# Altium schematic sheet bme_radar.SchDoc
size A4; SheetNumber: 1; SheetTotal: 1
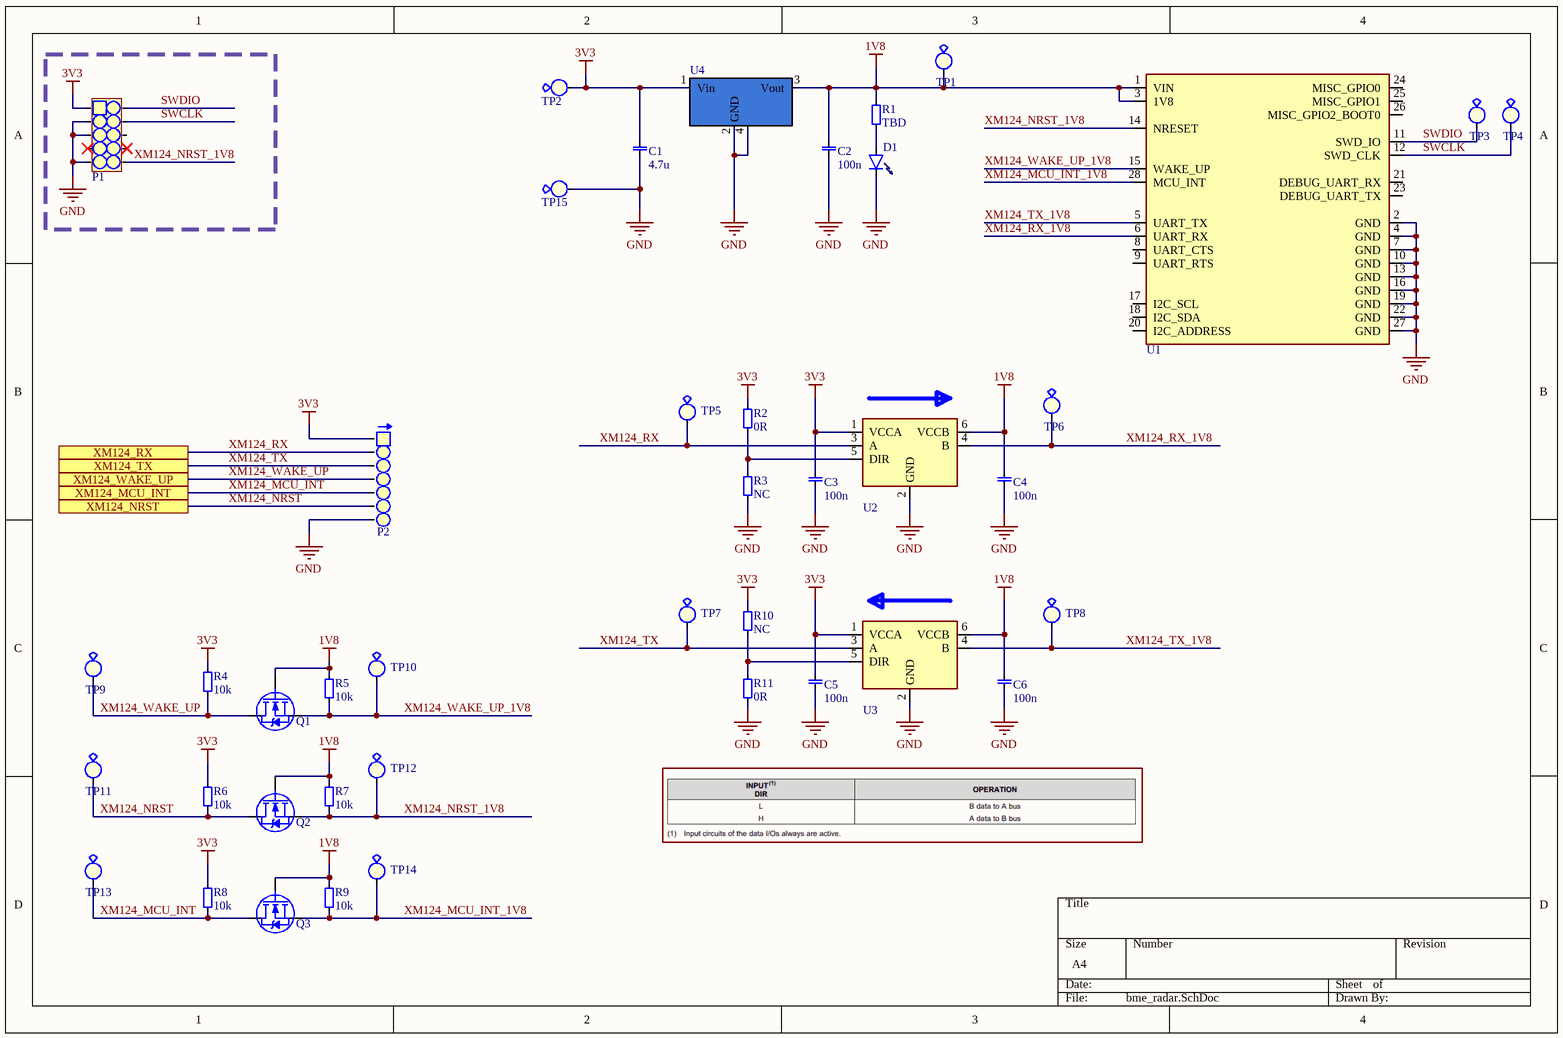
[diagram p0: bme_radar.SchDoc]

## Parts
C1  value 4.7u  [0805, cap]  (hidden comment: 0805, capacitor)
C2  value 100n  [0805, cap]  (hidden comment: 0805, capacitor)
C3  value 100n  [0402 CAP]  (hidden comment: 0603, capacitor)
C4  value 100n  [0402 CAP]  (hidden comment: 0603, capacitor)
C5  value 100n  [0402 CAP]  (hidden comment: 0603, capacitor)
C6  value 100n  [0402 CAP]  (hidden comment: 0603, capacitor)
D1  0603, LED  [0603 LED]  (value not drawn)
P1  ARM 10 pin SWD  [FTSH-105-01-L-DV-K even odd]  (value not drawn)
P2  1x7 Pin Header R/A  [1x7_HEADER_R/A]  (value not drawn)
Q1  BSS138  [SOT323]  (value not drawn)
Q2  BSS138  [SOT323]  (value not drawn)
Q3  BSS138  [SOT323]  (value not drawn)
R1  value TBD  [0603]  (hidden comment: 0603, resistor)
R2  value 0R  [0402 res]  (hidden comment: 0603, resistor)
R3  value NC  [0402 res]  (hidden comment: 0603, resistor)
R4  value 10k  [0603]  (hidden comment: 0603, resistor)
R5  value 10k  [0603]  (hidden comment: 0603, resistor)
R6  value 10k  [0603]  (hidden comment: 0603, resistor)
R7  value 10k  [0603]  (hidden comment: 0603, resistor)
R8  value 10k  [0603]  (hidden comment: 0603, resistor)
R9  value 10k  [0603]  (hidden comment: 0603, resistor)
R10  value NC  [0402 res]  (hidden comment: 0603, resistor)
R11  value 0R  [0402 res]  (hidden comment: 0603, resistor)
TP1  Test Point  [TESTPOINT_SMD]  (value not drawn)
TP2  Test Point  [TESTPOINT_SMD]  (value not drawn)
TP3  Test Point  [TESTPOINT_SMD]  (value not drawn)
TP4  Test Point  [TESTPOINT_SMD]  (value not drawn)
TP5  Test Point  [TESTPOINT_SMD]  (value not drawn)
TP6  Test Point  [TESTPOINT_SMD]  (value not drawn)
TP7  Test Point  [TESTPOINT_SMD]  (value not drawn)
TP8  Test Point  [TESTPOINT_SMD]  (value not drawn)
TP9  Test Point  [TESTPOINT_SMD]  (value not drawn)
TP10  Test Point  [TESTPOINT_SMD]  (value not drawn)
TP11  Test Point  [TESTPOINT_SMD]  (value not drawn)
TP12  Test Point  [TESTPOINT_SMD]  (value not drawn)
TP13  Test Point  [TESTPOINT_SMD]  (value not drawn)
TP14  Test Point  [TESTPOINT_SMD]  (value not drawn)
TP15  Test Point  [TESTPOINT_SMD]  (value not drawn)
U1  XM124  [XM124]  (value not drawn)
U2  SN74AXC1T45-Q1  [SOT65P210X110-6N]  (value not drawn)
U3  SN74AXC1T45-Q1  [SOT65P210X110-6N]  (value not drawn)
U4  3.3V Reg  [SOT223]  (value not drawn)

## Ports
XM124_MCU_INT, XM124_NRST, XM124_RX, XM124_TX, XM124_WAKE_UP

## Nets
1V8: C2.1 C4.1 C6.1 Q1.1(G) Q2.1(G) Q3.1(G) R1.1 R5.1 R7.1 R9.1 TP1.0 U1.1(VIN) U1.3(1V8) U2.6(VCCB) U3.6(VCCB) U4.3(Vout)
3V3: C1.1 C3.1 C5.1 P1.1 P2.1 R2.0 R4.1 R6.1 R8.1 R10.0 TP2.0 U2.1(VCCA) U3.1(VCCA) U4.1(Vin)
GND: C1.0 C2.0 C3.0 C4.0 C5.0 C6.0 D1.0(Cathode) P1.3 P1.5 P1.9 P2.7 R3.1 R11.1 TP15.0 U1.2(GND) U1.4(GND) U1.7(GND) U1.10(GND) U1.13(GND) U1.16(GND) U1.19(GND) U1.22(GND) U1.27(GND) U2.2(GND) U3.2(GND) U4.2(GND) U4.4
SWCLK: P1.4 TP4.0 U1.12(SWD_CLK)
SWDIO: P1.2 TP3.0 U1.11(SWD_IO)
XM124_MCU_INT: P2.5 Q3.2(D) R8.0 TP13.0 ; port XM124_MCU_INT
XM124_MCU_INT_1V8: Q3.3(S) R9.0 TP14.0 U1.28(MCU_INT)
XM124_NRST: P2.6 Q2.2(D) R6.0 TP11.0 ; port XM124_NRST
XM124_NRST_1V8: P1.10 Q2.3(S) R7.0 TP12.0 U1.14(NRESET)
XM124_RX: P2.2 TP5.0 U2.3(A) ; port XM124_RX
XM124_RX_1V8: TP6.0 U1.6(UART_RX) U2.4(B)
XM124_TX: P2.3 TP7.0 U3.3(A) ; port XM124_TX
XM124_TX_1V8: TP8.0 U1.5(UART_TX) U3.4(B)
XM124_WAKE_UP: P2.4 Q1.2(D) R4.0 TP9.0 ; port XM124_WAKE_UP
XM124_WAKE_UP_1V8: Q1.3(S) R5.0 TP10.0 U1.15(WAKE_UP)
NetD1_1: D1.1 R1.0
NetR2_1: R2.1 R3.0 U2.5(DIR)
NetR10_1: R10.1 R11.0 U3.5(DIR)

Not connected (* = marked no-connect by the designer): P1 6 7* 8*; U1 8(UART_CTS) 9(UART_RTS) 17(I2C_SCL) 18(I2C_SDA) 20(I2C_ADDRESS) 21(DEBUG_UART_RX) 23(DEBUG_UART_TX) 24(MISC_GPIO0) 25(MISC_GPIO1) 26(MISC_GPIO2_BOOT0)

## Library data of the parts
C1 = 0805, capacitor: Manufacturer Part No: CL21A475KAQNNNE
C2 = 0805, capacitor: Manufacturer Part No: C0805C104M5RAC7800
C3-C6 = 0603, capacitor: Manufacturer Part No: GRM155R62A104KE14D; Order number: *
D1 = 0603, LED: Manufacturer Part No: 150060SS75003
P1 = ARM 10 pin SWD: 1.27mm, PH; Manufacturer Part No: FTSH-105-01-L-DV-K; Value: 2x5 Pin Header, 2.54mm, Th
P2 = 1x7 Pin Header R/A: 1.27 mm; Manufacturer Part No: TMS-107-01-L-S-RA; Value: 1x8 Pin Header
Q1-Q3 = BSS138: N-Channel Logic Level Enhancement Mode Field Effect Transistor; Manufacturer Part No: BSS138W-7-F; Value: N-Channel MOSFET
R2 R3 R10 R11 = 0603, resistor: Manufacturer Part No: RMCF0402ZT0R00
R4-R9 = 0603, resistor: Manufacturer Part No: CR0603-16W-1002FT
U1 = XM124: RF IC Sensor Radar 60GHz; Manufacturer Part No: XM124; Value: Radar
U2 U3 = SN74AXC1T45-Q1: Automotive Qualified Single-Bit Dual-Supply Bus Transceiver with Configurable Voltage Translation, Tri-State Outputs; Manufacturer Part No: SN74AXC1T45QDCKRQ1; Value: Level Translator
U4 = MCP1826S: 1 A, Positive Fixed-Voltage, Low-ccDropout Regulator; Manufacturer Part No: MCP1826ST-1802E/DB; Drop Out: 250mV; Value: MCP1826S
TP1-TP15 = Test Point: Value: Test point; Farnell: 1702006